# Altium schematic sheet Current_Sense.SchDoc
size A4; SheetNumber: 3; SheetTotal: 10
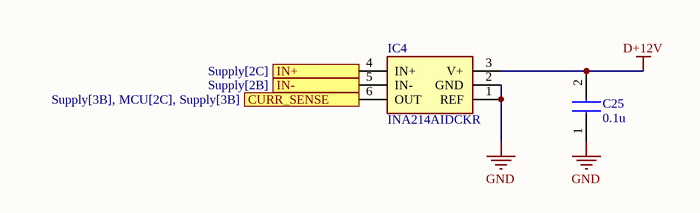
[diagram p0: Current_Sense.SchDoc]

## Parts
C25  0.1u  [CAPC1608X90N]
IC4  INA214AIDCKR  [SOT65P210X110-6N]

## Ports
CURR_SENSE (out, see Supply[3B], MCU[2C], Supply[3B]), IN+ (in, see Supply[2C]), IN- (in, see Supply[2B])

## Nets
D+12V: C25.2 IC4.3(V+)
GND: C25.1 IC4.1(REF) IC4.2(GND)
CURR_SENSE: IC4.6(OUT) ; port CURR_SENSE
IN+: IC4.4(IN+) ; port IN+
IN-: IC4.5(IN-) ; port IN-

## Library data of the parts
C25 = CC0603KRX7R8BB104: Manufacturer_Name: KEMET; Datasheet Link: https://datasheet.datasheetarchive.com/originals/distributors/Datasheets_SAMA/d9f127a4875522309d99aa7dec79633c.pdf; Height: 0.9mm; Manufacturer_Part_Number: CC0603KRX7R8BB104; Mouser Part Number: 603-CC603KRX7R8BB104; Mouser Price/Stock: https://www.mouser.co.uk/ProductDetail/Yageo/CC0603KRX7R8BB104?qs=AgBp2OyFlx%252B4QOgEm%2Fb3YQ%3D%3D; Arrow Part Number: CC0603KRX7R8BB104; Arrow Price/Stock: https://www.arrow.com/en/products/cc0603krx7r8bb104/yageo
IC4 = INA214AIDCKR: Integrated Circuit; Manufacturer_Name: Texas Instruments; Datasheet Link: https://datasheet.lcsc.com/szlcsc/Texas-Instruments-TI-INA214AIDCKR_C105240.pdf; Height: 1.1mm; Manufacturer_Part_Number: INA214AIDCKR; Mouser Part Number: 595-INA214AIDCKR; Mouser Price/Stock: https://www.mouser.co.uk/ProductDetail/Texas-Instruments/INA214AIDCKR?qs=wCchVgLzAYyu8hCuRiPIXw%3D%3D; Arrow Part Number: INA214AIDCKR; Arrow Price/Stock: https://www.arrow.com/en/products/ina214aidckr/texas-instruments?region=nac